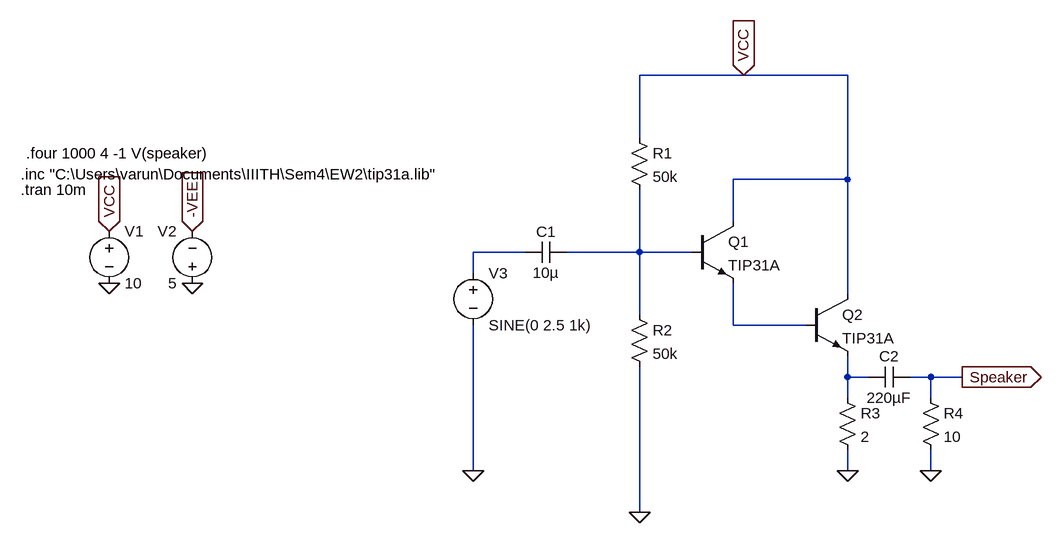
[diagram p0: schematic Darlington.asc]
Darlington.asc, the LTspice schematic file:
Version 4
SHEET 1 972 1224
WIRE 496 464 336 464
WIRE 656 464 496 464
WIRE 336 560 336 464
WIRE 656 624 656 464
WIRE 656 624 480 624
WIRE 480 688 480 624
WIRE 160 736 80 736
WIRE 336 736 336 640
WIRE 336 736 224 736
WIRE 416 736 336 736
WIRE 80 768 80 736
WIRE 656 800 656 624
WIRE 336 832 336 736
WIRE 480 848 480 784
WIRE 592 848 480 848
WIRE 656 928 656 896
WIRE 688 928 656 928
WIRE 784 928 752 928
WIRE 832 928 784 928
WIRE 656 960 656 928
WIRE 784 960 784 928
WIRE 80 1072 80 848
WIRE 656 1072 656 1040
WIRE 784 1072 784 1040
WIRE 336 1136 336 912
FLAG -480 704 VCC
IOPIN -480 704 In
FLAG -352 784 0
FLAG -480 784 0
FLAG -352 704 -VEE
IOPIN -352 704 In
FLAG 496 464 VCC
IOPIN 496 464 In
FLAG 336 1136 0
FLAG 832 928 Speaker
IOPIN 832 928 Out
FLAG 656 1072 0
FLAG 80 1072 0
FLAG 784 1072 0
SYMBOL npn 416 688 R0
SYMATTR InstName Q1
SYMATTR Value TIP31A
SYMBOL voltage -480 688 R0
SYMATTR InstName V1
SYMATTR Value 10
SYMBOL voltage -352 800 R180
WINDOW 0 24 96 Left 2
WINDOW 3 24 16 Left 2
SYMATTR InstName V2
SYMATTR Value 5
SYMBOL npn 592 800 R0
SYMATTR InstName Q2
SYMATTR Value TIP31A
SYMBOL res 320 544 R0
SYMATTR InstName R1
SYMATTR Value 50k
SYMBOL cap 224 720 R90
WINDOW 0 0 32 VBottom 2
WINDOW 3 32 32 VTop 2
SYMATTR InstName C1
SYMATTR Value 10µ
SYMBOL voltage 80 752 R0
WINDOW 123 0 0 Left 0
WINDOW 39 0 0 Left 0
SYMATTR InstName V3
SYMATTR Value SINE(0 2.5 1k)
SYMBOL res 320 816 R0
SYMATTR InstName R2
SYMATTR Value 50k
SYMBOL res 640 944 R0
SYMATTR InstName R3
SYMATTR Value 2
SYMBOL res 768 944 R0
SYMATTR InstName R4
SYMATTR Value 10
SYMBOL cap 752 912 R90
WINDOW 0 0 32 VBottom 2
WINDOW 3 32 32 VTop 2
SYMATTR InstName C2
SYMATTR Value 220µF
TEXT -616 616 Left 2 !.inc "C:\\Users\\varun\\Documents\\IIITH\\Sem4\\EW2\\tip31a.lib"
TEXT -616 640 Left 2 !.tran 10m
TEXT -608 584 Left 2 !.four 1000 4 -1 V(speaker)

The netlist it stands for:
* Darlington.asc
Q1 VCC N002 N003 0 TIP31A
V1 VCC 0 10
V2 0 -VEE 5
Q2 VCC N003 N004 0 TIP31A
R1 VCC N002 50k
C1 N002 N001 10µ
V3 N001 0 SINE(0 2.5 1k)
R2 N002 0 50k
R3 N004 0 2
R4 Speaker 0 10
C2 Speaker N004 220µF
.model NPN NPN
.model PNP PNP
.lib standard.bjt
.inc "C:\Users\varun\Documents\IIITH\Sem4\EW2\tip31a.lib"
.tran 10m
.four 1000 4 -1 V(speaker)
.backanno
.end